# Altium schematic sheet resistive_load_output.schdoc
size A3; Organization: Altium Limited; Address1: L3, 12a Rodborough Rd; Address2: Frenchs Forest; Address3: NSW; Address4: Australia 2086
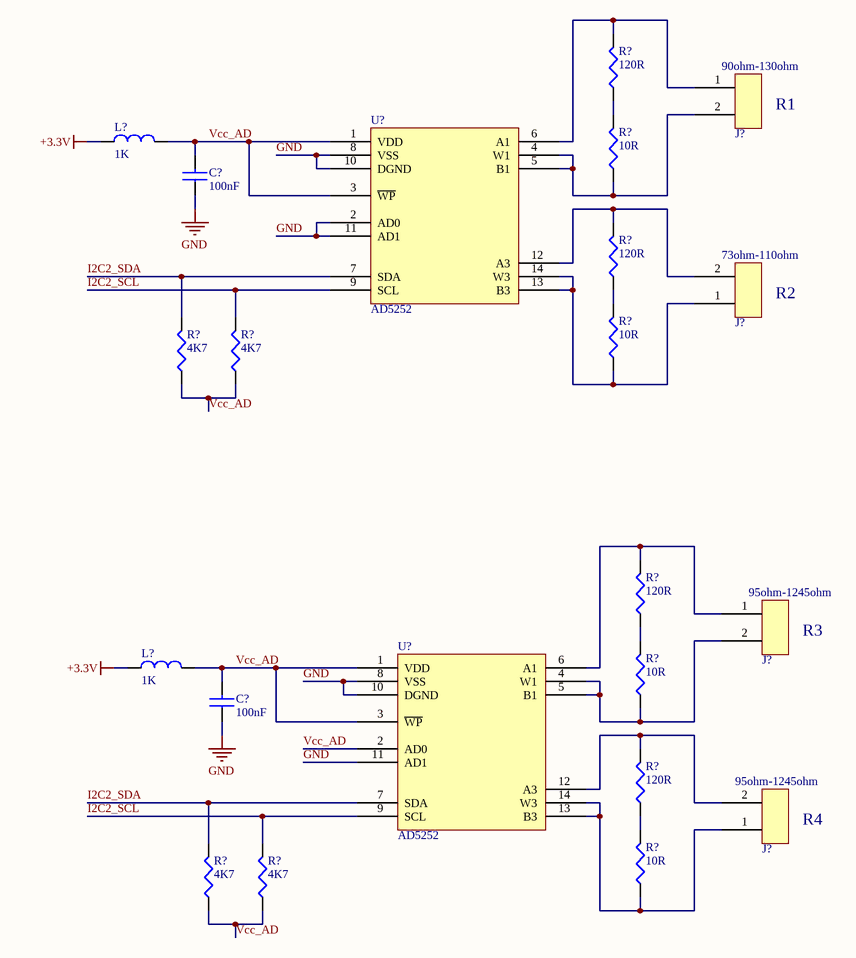
[diagram p0: resistive_load_output.schdoc]

## Parts
(Parts that share a designator on the sheet are numbered #1, #2 ... from top to bottom, then left to right.)
C?#1  value 100nF  [0805 SMD Ceramic Capacitor]  (hidden comment: C0805C104)
C?#2  value 100nF  [0805 SMD Ceramic Capacitor]  (hidden comment: C0805C104)
J?#1  2x Terminal  [2x Terminal mini]  (value not drawn)
J?#2  2x Terminal  [2x Terminal mini]  (value not drawn)
J?#3  2x Terminal  [2x Terminal mini]  (value not drawn)
J?#4  2x Terminal  [2x Terminal mini]  (value not drawn)
L?#1  value 1K  [0805 Inductor]  (hidden comment: 0805Ferrite)
L?#2  value 1K  [0805 Inductor]  (hidden comment: 0805Ferrite)
R?#1  value 120R  [0805 Resistor]  (hidden comment: 0805_120R)
R?#2  value 10R  [0805 Resistor]  (hidden comment: 0805_10R)
R?#3  value 120R  [0805 Resistor]  (hidden comment: 0805_120R)
R?#4  value 10R  [0805 Resistor]  (hidden comment: 0805_10R)
R?#5  value 4K7  [0805 Resistor]  (hidden comment: 0805_4K7%1)
R?#6  value 4K7  [0805 Resistor]  (hidden comment: 0805_4K7%1)
R?#7  value 120R  [0805 Resistor]  (hidden comment: 0805_120R)
R?#8  value 10R  [0805 Resistor]  (hidden comment: 0805_10R)
R?#9  value 120R  [0805 Resistor]  (hidden comment: 0805_120R)
R?#10  value 10R  [0805 Resistor]  (hidden comment: 0805_10R)
R?#11  value 4K7  [0805 Resistor]  (hidden comment: 0805_4K7%1)
R?#12  value 4K7  [0805 Resistor]  (hidden comment: 0805_4K7%1)
U?#1  value AD5252  [TSSOP14]  (hidden comment: U)
U?#2  value AD5252  [TSSOP14]  (hidden comment: U)

## Nets
+3.3V: L?#1.1 L?#2.1
GND: C?#1.1 C?#2.1 U?#1.2(AD0) U?#1.8(VSS) U?#1.10(DGND) U?#1.11(AD1) U?#2.8(VSS) U?#2.10(DGND) U?#2.11(AD1)
I2C2_SCL: R?#6.2 R?#12.2 U?#1.9(SCL) U?#2.9(SCL)
I2C2_SDA: R?#5.2 R?#11.2 U?#1.7(SDA) U?#2.7(SDA)
Vcc_AD: C?#1.2 C?#2.2 L?#1.2 L?#2.2 R?#5.1 R?#6.1 R?#11.1 R?#12.1 U?#1.1(VDD) U?#1.3(~{WP}) U?#2.1(VDD) U?#2.2(AD0) U?#2.3(~{WP})
NetJ?#1_1: J?#1.1 R?#1.2 U?#1.6(A1)
NetJ?#1_2: J?#1.2 R?#2.1 U?#1.4(W1) U?#1.5(B1)
NetJ?#2_1: J?#2.1 R?#4.1 U?#1.13(B3) U?#1.14(W3)
NetJ?#2_2: J?#2.2 R?#3.2 U?#1.12(A3)
NetJ?#3_1: J?#3.1 R?#7.2 U?#2.6(A1)
NetJ?#3_2: J?#3.2 R?#8.1 U?#2.4(W1) U?#2.5(B1)
NetJ?#4_1: J?#4.1 R?#10.1 U?#2.13(B3) U?#2.14(W3)
NetJ?#4_2: J?#4.2 R?#9.2 U?#2.12(A3)
NetR?#1_1: R?#1.1 R?#2.2
NetR?#3_1: R?#3.1 R?#4.2
NetR?#7_1: R?#7.1 R?#8.2
NetR?#9_1: R?#9.1 R?#10.2

## Notes on the sheet
- (near J?#1) 90ohm-130ohm
- (near J?#1) R1
- (near J?#2) 73ohm-110ohm
- (near J?#2) R2
- (near J?#3) 95ohm-1245ohm
- (near J?#3) R3
- (near J?#4) 95ohm-1245ohm
- (near J?#4) R4
- Title
- Size:
- Date:
- A3
- Number:
- Time:
- Revision:
- Sheet
- of
- File:

## Library data of the parts
C?#1 C?#2 = C0805C104: Manufacturer Code: C0805C104J5RACTU; Manufacturer: KEMET; Voltage: 50V; Farnell Code: 1414663; Unit Price: 0,06 €; Package: 0805
J?#1-J?#4 = 2x Terminal: Manufacturer: WEIDMULLER; Manufacturer Code: PM5.08/2/90 BLK; Value: 2x Terminal; Farnell Code: 1131855; Unit Price: 0,55 €
L?#1 L?#2 = 0805Ferrite: Manufacturer Code: MMZ2012R102A; Manufacturer: TDK; Current: 500mA; Farnell Code: 1669719; Unit Price: 0,059 €
R?#1 R?#3 R?#7 R?#9 = 0805_120R: Manufacturer Code: MC 0.1W 0805 1% 120R; Manufacturer: MULTICOMP; Tolerance: ±1%; Farnell Code: 9332480; Unit Price: 0,03 €
R?#2 R?#4 R?#8 R?#10 = 0805_10R: Manufacturer Code: CRCW080510R0FKEA; Manufacturer: VISHAY DRALORIC; Tolerance: ±1%; Farnell Code: 1469859; Unit Price: 0,017 €
R?#5 R?#6 R?#11 R?#12 = 0805_4K7%1: Manufacturer Code: PCF0805P-R-4K7-BT1; Manufacturer: WELWYN; Tolerance: ±0.1%; Temperature Coefficient: ±25ppm/°C; Power Rating: 100mW; Unit Price: 0,34; Farnell Code: 1506096; MOQ: 5
U?#1 U?#2 = AD5252: Manufacturer Code: AD5252BRUZ1; Manufacturer: Analog Devices Inc.; Unit Price: 4,26$